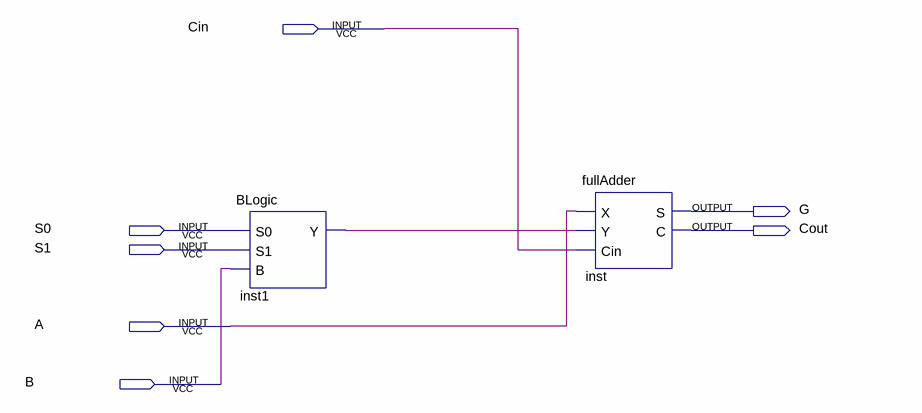
[diagram p0: schematic sheet]
// Quartus schematic 1BitAU.bdf as structural Verilog: 2 symbols, 7 pins
module \1BitAU  (
  input  Cin,
  input  S0,
  input  S1,
  input  A,
  input  B,
  output G,
  output Cout
);

  wire inst1_y;

  BLogic inst1 (.S0(S0), .S1(S1), .B(B), .Y(inst1_y));
  fullAdder inst (.X(A), .Y(inst1_y), .Cin(Cin), .S(G), .C(Cout));
endmodule
